# EAGLE design impedance02 (EAGLE 5.10)
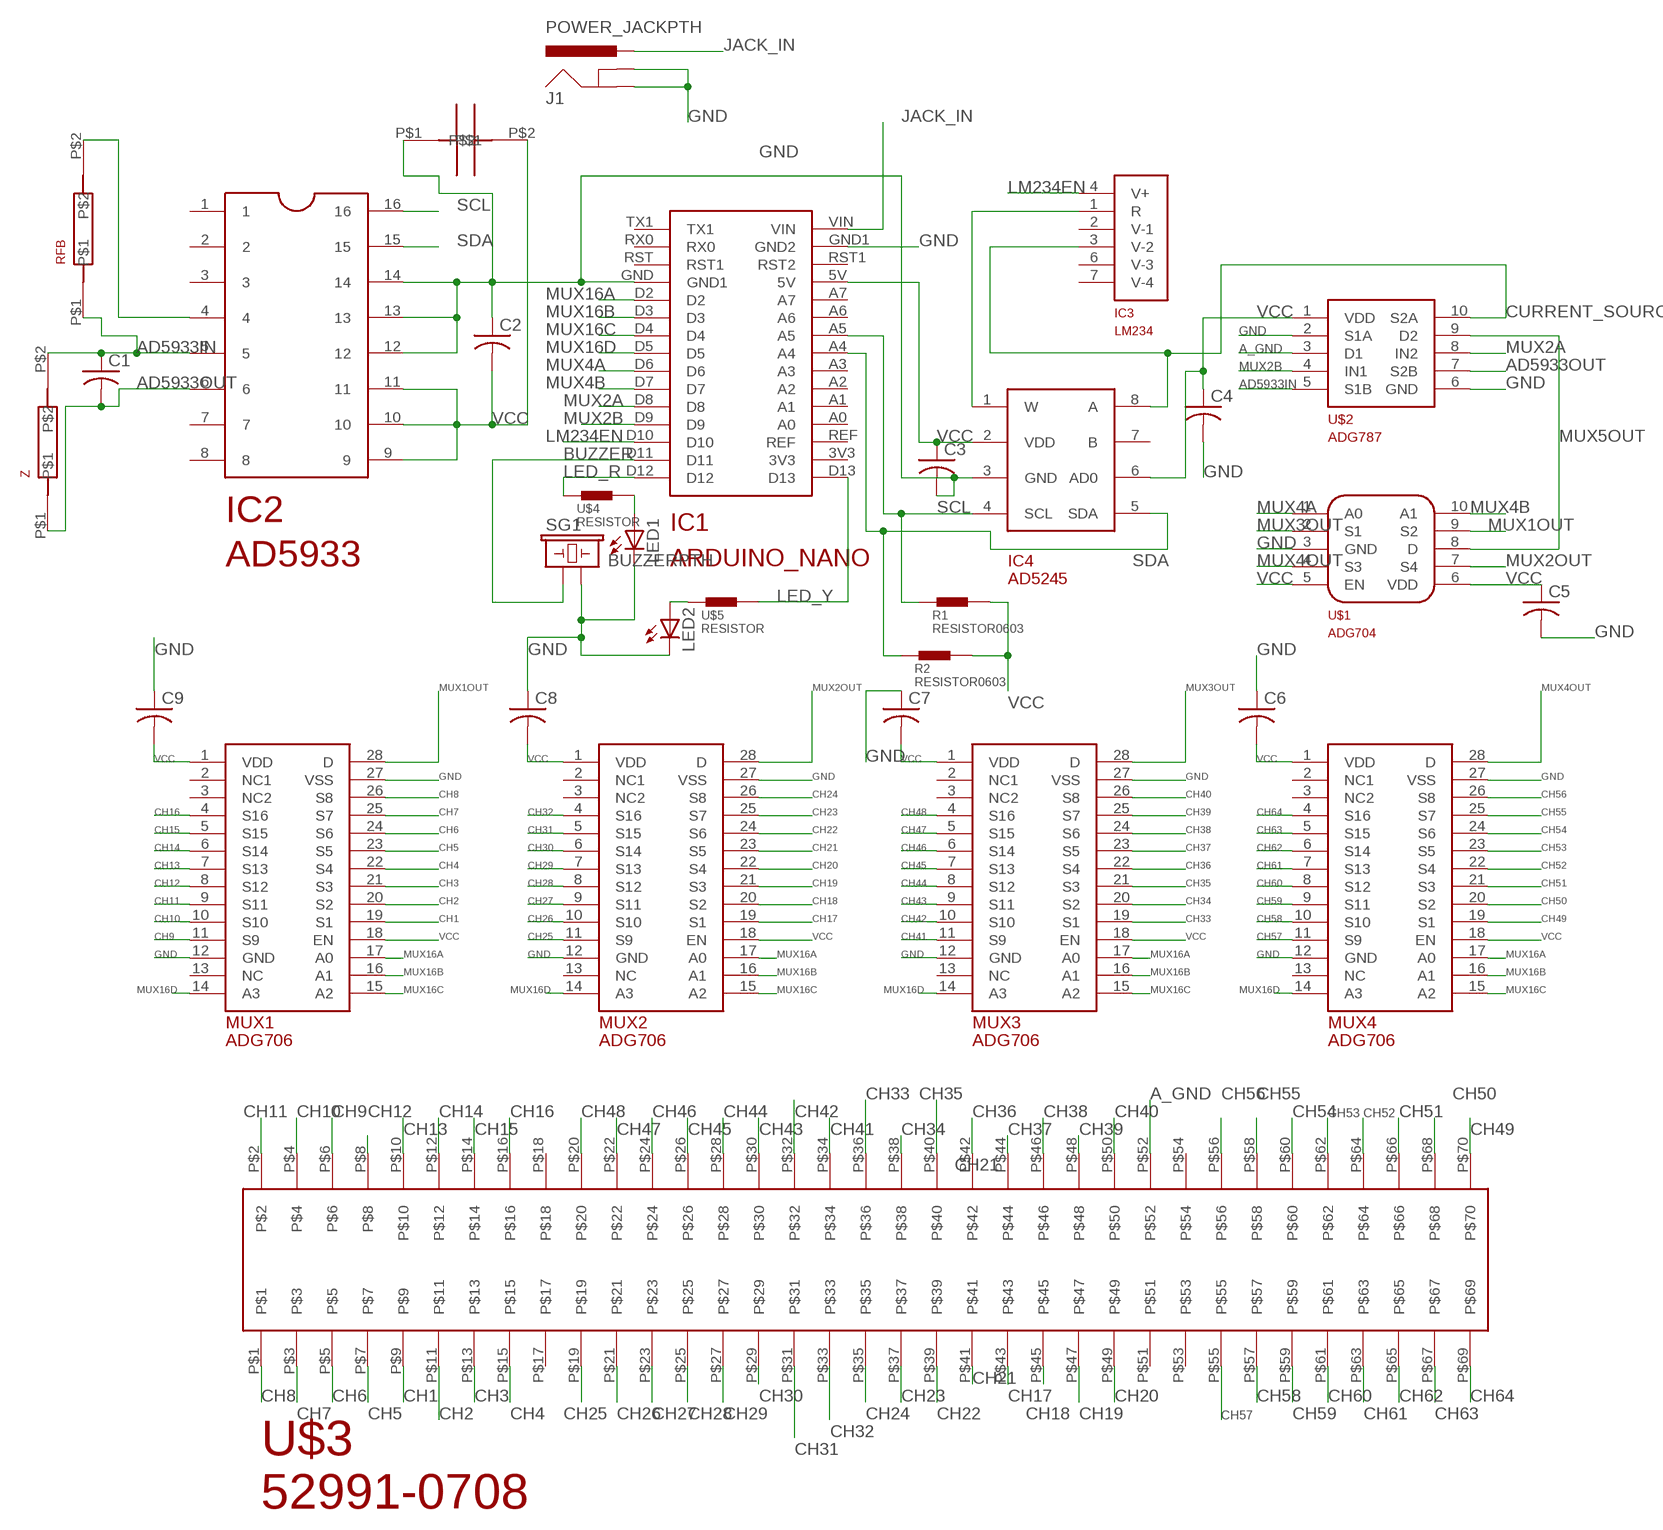
[diagram p0: schematic, sheet 1]

## Parts
C1  C-USC0603  [C0603]
C2  C-USC0603  [C0603]
C3  C-USC0603  [C0603]
C4  C-USC0603  [C0603]
C5  C-USC0603  [C0603]
C6  C-USC0603  [C0603]
C7  C-USC0603  [C0603]
C8  C-USC0603  [C0603]
C9  C-USC0603  [C0603]
IC1  ARDUINO_NANO  [ARDUINO_NANO]
IC2  AD5933  [AD5933]
IC3  LM234  [LM234]
IC4  AD5245  [AD5245]
J1  POWER_JACKPTH  [POWER_JACK_PTH]
LED1  LED5MM  [LED5MM]
LED2  LED5MM  [LED5MM]
MUX1  ADG706  [TSSOP28]
MUX2  ADG706  [TSSOP28]
MUX3  ADG706  [TSSOP28]
MUX4  ADG706  [TSSOP28]
R1  RESISTOR0603  [0603]
R2  RESISTOR0603  [0603]
RFB  RESISTOR_PTH  [RESISTOR_PTH]
SG1  BUZZERPTH  [BUZZER-12MM]
U$1  ADG704  [MICROSOIC10]
U$2  ADG787  [MSOP10]
U$3  52991-0708  [52991-0708]
U$4  RESISTOR  [RESISTOR]
U$5  RESISTOR  [RESISTOR]
U$6  CAPACITOR_PTH  [CAPACITOR_PTH]
Z  RESISTOR_PTH  [RESISTOR_PTH]

## Nets
A_GND: U$2.3(D1) U$3.P$52
AD5933IN: C1.1 IC2.5 RFB.P$1 U$2.5(S1B) Z.P$2
AD5933OUT: C1.2 IC2.6 U$2.7(S2B) Z.P$1
BUZZER: IC1.D11 SG1.+
CH1: MUX1.19(S1) U$3.P$9
CH2: MUX1.20(S2) U$3.P$11
CH3: MUX1.21(S3) U$3.P$13
CH4: MUX1.22(S4) U$3.P$15
CH5: MUX1.23(S5) U$3.P$7
CH6: MUX1.24(S6) U$3.P$5
CH7: MUX1.25(S7) U$3.P$3
CH8: MUX1.26(S8) U$3.P$1
CH9: MUX1.11(S9) U$3.P$6
CH10: MUX1.10(S10) U$3.P$4
CH11: MUX1.9(S11) U$3.P$2
CH12: MUX1.8(S12) U$3.P$8
CH13: MUX1.7(S13) U$3.P$10
CH14: MUX1.6(S14) U$3.P$12
CH15: MUX1.5(S15) U$3.P$14
CH16: MUX1.4(S16) U$3.P$16
CH17: MUX2.19(S1) U$3.P$43
CH18: MUX2.20(S2) U$3.P$45
CH19: MUX2.21(S3) U$3.P$47
CH20: MUX2.22(S4) U$3.P$49
CH21: MUX2.23(S5) U$3.P$41
CH22: MUX2.24(S6) U$3.P$39
CH23: MUX2.25(S7) U$3.P$37
CH24: MUX2.26(S8) U$3.P$35
CH25: MUX2.11(S9) U$3.P$19
CH26: MUX2.10(S10) U$3.P$21
CH27: MUX2.9(S11) U$3.P$23
CH28: MUX2.8(S12) U$3.P$25
CH29: MUX2.7(S13) U$3.P$27
CH30: MUX2.6(S14) U$3.P$29
CH31: MUX2.5(S15) U$3.P$31
CH32: MUX2.4(S16) U$3.P$33
CH33: MUX3.19(S1) U$3.P$36
CH34: MUX3.20(S2) U$3.P$38
CH35: MUX3.21(S3) U$3.P$40
CH36: MUX3.22(S4) U$3.P$42
CH37: MUX3.23(S5) U$3.P$44
CH38: MUX3.24(S6) U$3.P$46
CH39: MUX3.25(S7) U$3.P$48
CH40: MUX3.26(S8) U$3.P$50
CH41: MUX3.11(S9) U$3.P$34
CH42: MUX3.10(S10) U$3.P$32
CH43: MUX3.9(S11) U$3.P$30
CH44: MUX3.8(S12) U$3.P$28
CH45: MUX3.7(S13) U$3.P$26
CH46: MUX3.6(S14) U$3.P$24
CH47: MUX3.5(S15) U$3.P$22
CH48: MUX3.4(S16) U$3.P$20
CH49: MUX4.19(S1) U$3.P$70
CH50: MUX4.20(S2) U$3.P$68
CH51: MUX4.21(S3) U$3.P$66
CH52: MUX4.22(S4) U$3.P$64
CH53: MUX4.23(S5) U$3.P$62
CH54: MUX4.24(S6) U$3.P$60
CH55: MUX4.25(S7) U$3.P$58
CH56: MUX4.26(S8) U$3.P$56
CH57: MUX4.11(S9) U$3.P$55
CH58: MUX4.10(S10) U$3.P$57
CH59: MUX4.9(S11) U$3.P$59
CH60: MUX4.8(S12) U$3.P$61
CH61: MUX4.7(S13) U$3.P$63
CH62: MUX4.6(S14) U$3.P$65
CH63: MUX4.5(S15) U$3.P$67
CH64: MUX4.4(S16) U$3.P$69
CURRENT_SOURCE: IC3.3(V-2) IC4.8(A) U$2.10(S2A)
GND: C2.1 C3.2 C4.2 C5.2 C6.1 C7.1 C8.1 C9.1 IC1.GND1(GND2) IC1.GND(GND1) IC2.12 IC2.13 IC2.14 IC4.3(GND) J1.GND J1.GNDBREAK LED1.K(C) LED2.K(C) MUX1.12(GND) MUX1.27(VSS) MUX2.12(GND) MUX2.27(VSS) MUX3.12(GND) MUX3.27(VSS) MUX4.12(GND) MUX4.27(VSS) SG1.- U$1.3(GND) U$2.2(S1A) U$2.6(GND) U$6.P$1
JACK_IN: IC1.VIN J1.PWR
LED_R: IC1.D12 U$4.P$1(P2)
LED_Y: IC1.D13 U$5.P$2(P1)
LM234EN: IC1.D10 IC3.4(V+)
MUX1OUT: MUX1.28(D) U$1.9(S2)
MUX2A: IC1.D8 U$2.8(IN2)
MUX2B: IC1.D9 U$2.4(IN1)
MUX2OUT: MUX2.28(D) U$1.7(S4)
MUX3OUT: MUX3.28(D) U$1.2(S1)
MUX4A: IC1.D6 U$1.1(A0)
MUX4B: IC1.D7 U$1.10(A1)
MUX4OUT: MUX4.28(D) U$1.4(S3)
MUX5OUT: U$1.8(D) U$2.9(D2)
MUX16A: IC1.D2 MUX1.17(A0) MUX2.17(A0) MUX3.17(A0) MUX4.17(A0)
MUX16B: IC1.D3 MUX1.16(A1) MUX2.16(A1) MUX3.16(A1) MUX4.16(A1)
MUX16C: IC1.D4 MUX1.15(A2) MUX2.15(A2) MUX3.15(A2) MUX4.15(A2)
MUX16D: IC1.D5 MUX1.14(A3) MUX2.14(A3) MUX3.14(A3) MUX4.14(A3)
N$1: LED1.A U$4.P$2(P1)
N$2: IC3.1(R) IC4.1(W)
N$3: IC2.4 RFB.P$2
N$4: LED2.A U$5.P$1(P2)
SCL: IC1.A5 IC2.16 IC4.4(SCL) R1.P$2(P2)
SDA: IC1.A4 IC2.15 IC4.5(SDA) R2.P$2(P2)
VCC: C2.2 C3.1 C4.1 C5.1 C6.2 C7.2 C8.2 C9.2 IC1.5V IC2.9 IC2.10 IC2.11 IC4.2(VDD) IC4.6(AD0) MUX1.1(VDD) MUX1.18(EN) MUX2.1(VDD) MUX2.18(EN) MUX3.1(VDD) MUX3.18(EN) MUX4.1(VDD) MUX4.18(EN) R1.P$1(P1) R2.P$1(P1) U$1.5(EN) U$1.6(VDD) U$2.1(VDD) U$6.P$2
Unconnected: IC1.3V3 IC1.A0 IC1.A1 IC1.A2 IC1.A3 IC1.A6 IC1.A7 IC1.REF IC1.RST1(RST2) IC1.RST(RST1) IC1.RX0 IC1.TX1 IC2.1 IC2.2 IC2.3 IC2.7 IC2.8 IC3.2(V-1) IC3.6(V-3) IC3.7(V-4) IC4.7(B) MUX1.2(NC1) MUX1.3(NC2) MUX1.13(NC) MUX2.2(NC1) MUX2.3(NC2) MUX2.13(NC) MUX3.2(NC1) MUX3.3(NC2) MUX3.13(NC) MUX4.2(NC1) MUX4.3(NC2) MUX4.13(NC) U$3.P$17 U$3.P$18 U$3.P$51 U$3.P$53 U$3.P$54

## Library data of the parts
C1-C9 = resistor:C-US: CAPACITOR, American symbol
IC1 = josh:ARDUINO_NANO
IC2 = analog-devices:AD5933
IC3 = josh:LM234
IC4 = analog-devices:AD5245
J1 = sparkfun:POWER_JACK: Power Jack This is the standard 5.5mm barrel jack for power. The PTH is the most common, proven, reliable, footprint. All others are experimental. The Slot footprint only works if the mill layer is transmitted to the PCB fab house so be warned. Spark Fun Electronics SKU : PRT-00119. Mating wall wart : TOL-00298 (and others)
LED1 LED2 = sparkfun:LED: LEDs Standard schematic elements and footprints for 5mm, 3mm, 1206, and 0603 sized LEDs. 5mm - Spark Fun Electronics SKU : COM-00529 (and others)
MUX1-MUX4 = analog-devices:ADG706
R1 R2 U$4 U$5 = josh:RESISTOR
RFB Z = josh:RESISTOR_PTH
SG1 = sparkfun:BUZZER: Buzzer 12mm Spark Fun Electronics SKU : Comp-Buzzer
U$1 = analog-devices:ADG704
U$2 = analog-devices:ADG787
U$3 = molex:52991-0708
U$6 = josh:CAPACITOR_PTH

## Board
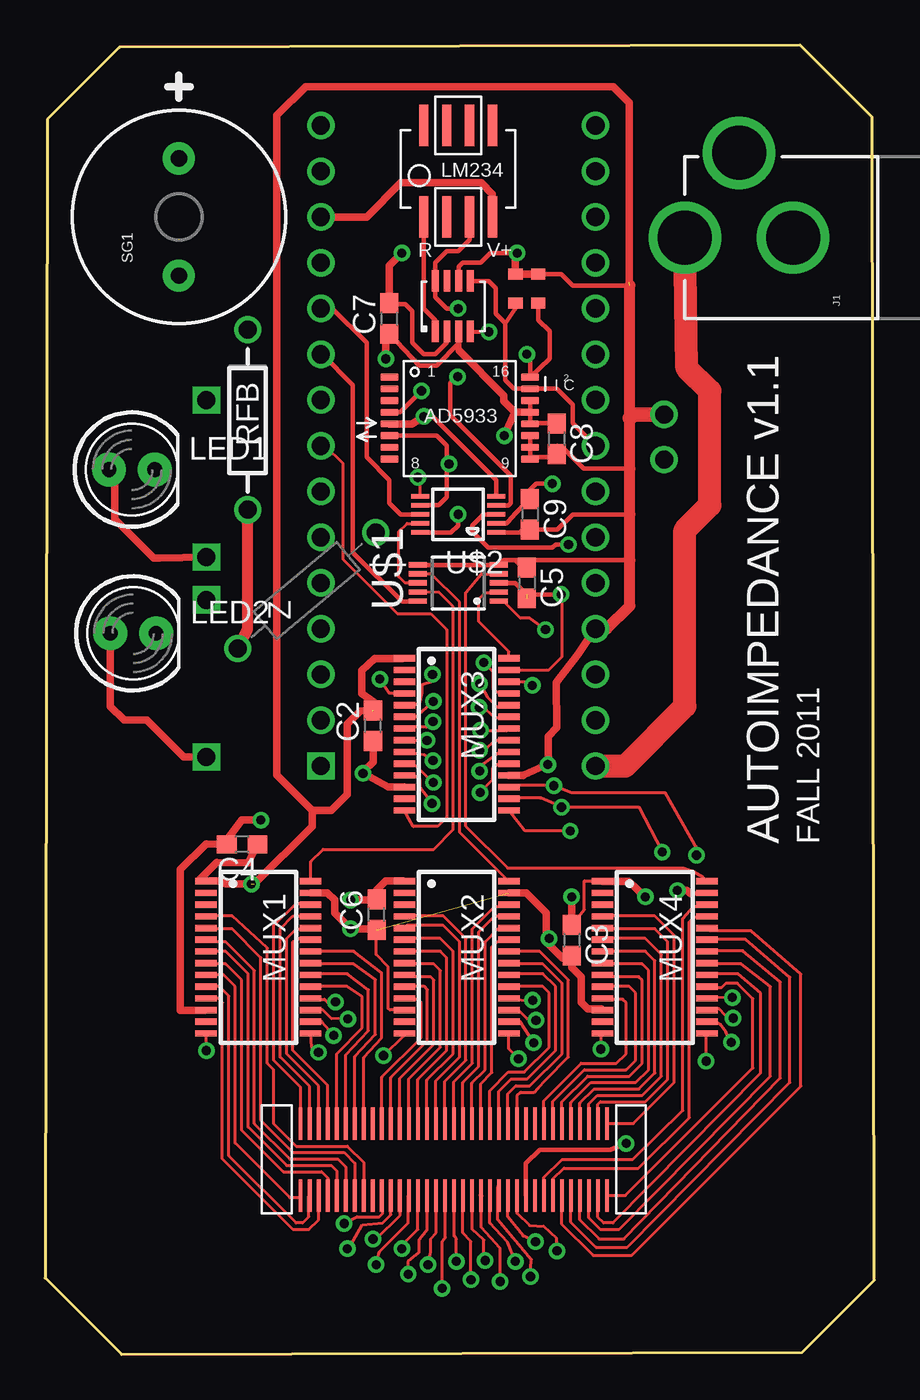
[diagram p1: board, top side]
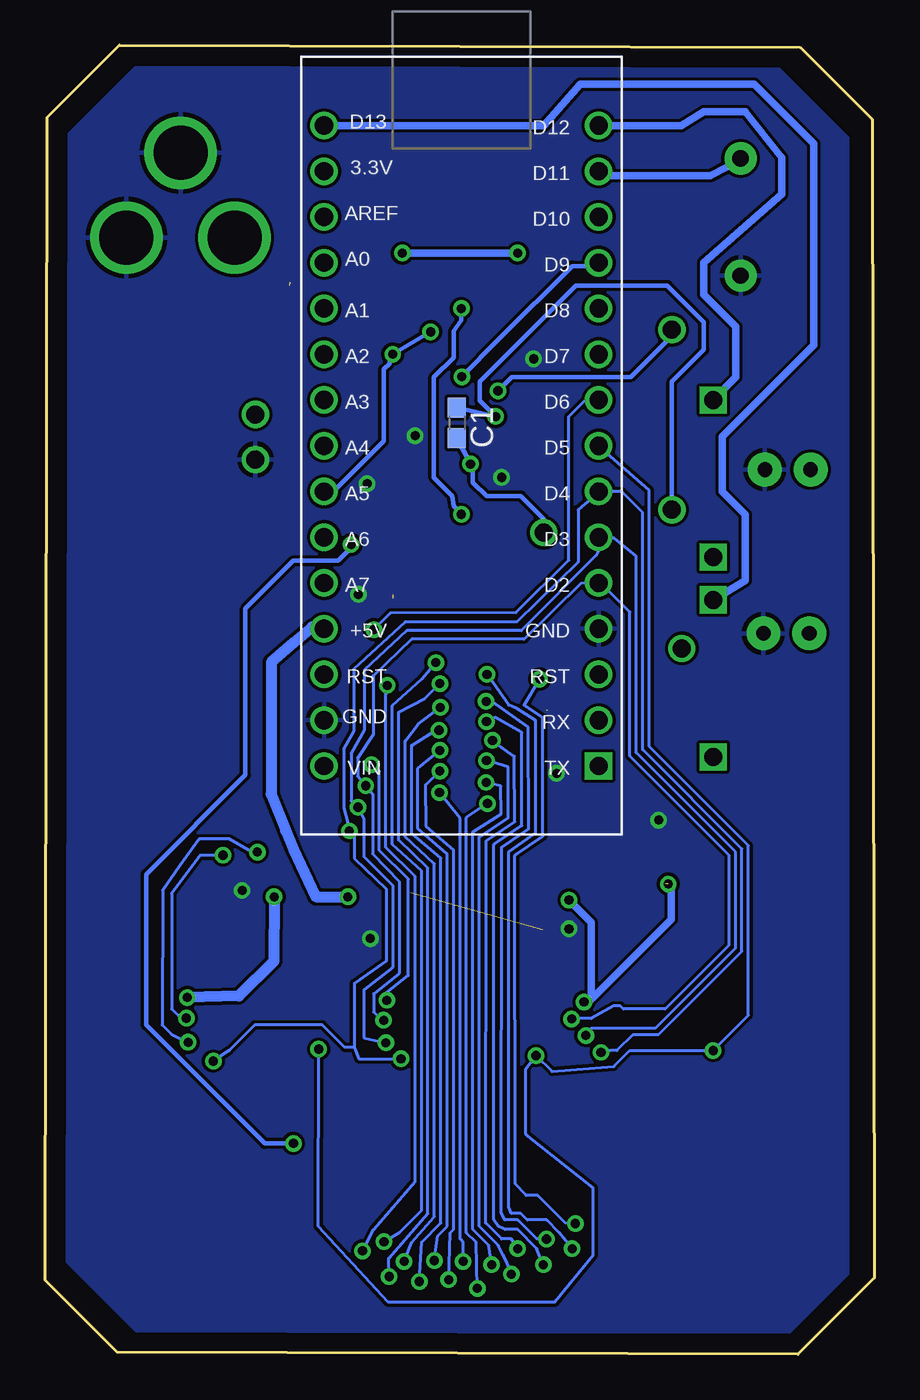
[diagram p2: board, bottom side, seen from below]

Size 46.03 x 72.7 mm. Coordinates in mm from the lower left corner, seen from the top.
Outline: 0.13,68.57 0,4.25 4.25,0 42.03,0.13 46.03,4.13 45.91,68.7 41.91,72.7 4.13,72.57 0.13,68.57
Copper layers (1*16): Top 0.035mm / dielectric 1.5mm / Bottom 0.035mm
Design rules "default *": minimum track width 7mil, minimum drill 20mil, track to track 7mil, track to pad 7mil, pad to pad 7mil, via to via 7mil, smd to smd 7mil, copper to edge 40mil, drill to drill 8mil, minimum pad ring 10mil, minimum via ring 8mil, stop-mask expansion 4mil, vias tented up to drill 0mil, thermal gap 10mil

### Footprints (pad centres in the part's own frame; a part is rotated, then mirrored left to right if it is on the bottom)
C0603 = smd 1.1 x 1: 1 -0.85,0; 2 0.85,0
ARDUINO_NANO = drill 1.016 round: 3V3 15.24,2.54; 5V 15.24,27.94; A0 15.24,7.62; A1 15.24,10.16; A2 15.24,12.7; A3 15.24,15.24; A4 15.24,17.78; A5 15.24,20.32; A6 15.24,22.86; A7 15.24,25.4; D2 0,25.4; D3 0,22.86; D4 0,20.32; D5 0,17.78; D6 0,15.24; D7 0,12.7; D8 0,10.16; D9 0,7.62; D10 0,5.08; D11 0,2.54; D12 0,0; D13 15.24,0; GND 15.24,33.02; GND1 0,27.94; REF 15.24,5.08; RST 15.24,30.48; RST1 0,30.48; RX0 0,33.02; VIN 15.24,35.56 | drill 1.016 square: TX1 0,35.56
AD5933 = smd 0.4 x 1: 1 0,0; 2 0.65,0; 3 1.3,0; 4 1.95,0; 5 2.6,0; 6 3.25,0; 7 3.9,0; 8 4.55,0; 9 4.55,7.8; 10 3.9,7.8; 11 3.25,7.8; 12 2.6,7.8; 13 1.95,7.8; 14 1.3,7.8; 15 0.65,7.8; 16 0,7.8
LM234 = smd 0.508 x 2.286: 1 0,0; 2 1.27,0; 3 2.54,0; 4 3.81,0; 5 3.81,5.08; 6 2.54,5.08; 7 1.27,5.08; 8 0,5.08
AD5245 = smd 0.38 x 1.2: 1 0,0; 2 0.65,0; 3 1.3,0; 4 1.95,0; 5 1.95,2.8; 6 1.3,2.8; 7 0.65,2.8; 8 0,2.8
POWER_JACK_PTH = drill 2.997 round: GND 0,7.7; GNDBREAK 4.7,10.7; PWR 0,13.7
LED5MM = drill 0.813 pad 1.88 round: A -1.27,0; K 1.27,0
TSSOP28 = smd 0.35 x 1.2: 1 -4.225,-2.9; 2 -3.575,-2.9; 3 -2.925,-2.9; 4 -2.275,-2.9; 5 -1.625,-2.9; 6 -0.975,-2.9; 7 -0.325,-2.9; 8 0.325,-2.9; 9 0.975,-2.9; 10 1.625,-2.9; 11 2.275,-2.9; 12 2.925,-2.9; 13 3.575,-2.9; 14 4.225,-2.9; 15 4.225,2.9; 16 3.575,2.9; 17 2.925,2.9; 18 2.275,2.9; 19 1.625,2.9; 20 0.975,2.9; 21 0.325,2.9; 22 -0.325,2.9; 23 -0.975,2.9; 24 -1.625,2.9; 25 -2.275,2.9; 26 -2.925,2.9; 27 -3.575,2.9; 28 -4.225,2.9
0603 = smd 0.6 x 0.8: P$1 0,0; P$2 1.6,0
RESISTOR_PTH = drill 1 round: P$1 0,0; P$2 10,0
BUZZER-12MM = drill 0.9 pad 1.778 round: + 3.25,0; - -3.25,0
MICROSOIC10 = smd 0.3 x 1: 1 -1,-2.25; 2 -0.5,-2.25; 3 0,-2.25; 4 0.5,-2.25; 5 1,-2.25; 6 1,2.25; 7 0.5,2.25; 8 0,2.25; 9 -0.5,2.25; 10 -1,2.25
MSOP10 = smd 0.25 x 1: 1 -1,-2.113; 2 -0.5,-2.113; 3 0,-2.113; 4 0.5,-2.113; 5 1,-2.113; 6 1,2.113; 7 0.5,2.113; 8 0,2.113; 9 -0.5,2.113; 10 -1,2.113
52991-0708 = smd 0.25 x 1.8: P$1 0,2; P$2 0,-2; P$3 0.5,2; P$4 0.5,-2; P$5 1,2; P$6 1,-2; P$7 1.5,2; P$8 1.5,-2; P$9 2,2; P$10 2,-2; P$11 2.5,2; P$12 2.5,-2; P$13 3,2; P$14 3,-2; P$15 3.5,2; P$16 3.5,-2; P$17 4,2; P$18 4,-2; P$19 4.5,2; P$20 4.5,-2; P$21 5,2; P$22 5,-2; P$23 5.5,2; P$24 5.5,-2; P$25 6,2; P$26 6,-2; P$27 6.5,2; P$28 6.5,-2; P$29 7,2; P$30 7,-2; P$31 7.5,2; P$32 7.5,-2; P$33 8,2; P$34 8,-2; P$35 8.5,2; P$36 8.5,-2; P$37 9,2; P$38 9,-2; P$39 9.5,2; P$40 9.5,-2; P$41 10,2; P$42 10,-2; P$43 10.5,2; P$44 10.5,-2; P$45 11,2; P$46 11,-2; P$47 11.5,2; P$48 11.5,-2; P$49 12,2; P$50 12,-2; P$51 12.5,2; P$52 12.5,-2; P$53 13,2; P$54 13,-2; P$55 13.5,2; P$56 13.5,-2; P$57 14,2; P$58 14,-2; P$59 14.5,2; P$60 14.5,-2; P$61 15,2; P$62 15,-2; P$63 15.5,2; P$64 15.5,-2; P$65 16,2; P$66 16,-2; P$67 16.5,2; P$68 16.5,-2; P$69 17,2; P$70 17,-2
RESISTOR = drill 1 square: P$1 -2.54,0; P$2 6.175,0
CAPACITOR_PTH = drill 1 round: P$1 0,0; P$2 2.5,0

### Placement (x,y rotation side)
C1  23.18,51.72 270 bottom
C2  18.2,34.91 90 top
C3  29.23,22.99 270 top
C4  10.94,28.33 180 top
C5  26.74,42.83 270 top
C6  18.4,24.42 90 top
C7  19.12,57.51 90 top
C8  28.39,50.83 270 top
C9  26.91,46.64 270 top
IC1  15.31,68.23 180 bottom
IC2  19.12,54.26 270 top
IC3  21.02,63.15 0 top
IC4  21.66,56.8 0 top
J1  49.21,62.01 90 top
LED1  4.82,49.13 0 top
LED2  4.89,40.04 0 top
MUX1  11.84,22.05 270 top
MUX2  22.84,22.05 270 top
MUX3  22.84,34.42 270 top
MUX4  33.84,22.05 270 top
R1  27.37,59.98 270 top
R2  26.1,59.98 270 top
RFB  11.24,46.9 90 top
SG1  7.43,63.15 90 top
U$1  22.93,42.83 90 top
U$2  22.93,46.64 90 top
U$3  14.19,10.83 0 top
U$4  8.96,50.45 270 top
U$5  8.96,35.72 90 top
U$6  34.36,49.69 90 top
Z  18.35,45.63 220 top

### Tracks (layer width: path | path; a pad name or v marks a point on that pad's centre or on a via)
A_GND  (via drill 0.51)
  Top 0.254: U$3.P$52 26.69,10.6 27.45,11.36 31.36,11.36 v32.25,11.72 | U$2.3 24.32,46.64 23.71,46.03 23.71,45.68 24.6,44.79 28.16,44.79 28.34,44.97 v29.05,44.97
  Bottom 0.254: v29.05,44.97 29.05,44.79 29.76,44.08 32.25,44.08 34.91,41.41 34.91,32.16 40.43,26.65 40.43,18.3 33.85,11.72 v32.25,11.72
AD5933IN  (via drill 0.51)
  Top 0.254: U$2.5 25.04,48.54 21.5,52.08 v21.02,52.08
  Top 0.406: IC2.5 20.35,51.66 v21.02,52.08
  Top 0.61: RFB.P$1 11.24,40.26 Z.P$2
  Bottom 0.254: C1.1 21.01,52.06 v21.02,52.08 21.91,52.97 21.91,54.01 16.58,59.34 11.5,59.34 9.46,57.31 9.46,55.79 11.24,54.01 RFB.P$1
AD5933OUT  (via drill 0.51)
  Top 0.254: IC2.6 21.73,51.01 22.29,50.45 22.29,49.56 | 22.29,49.56 22.29,47.6 21.84,47.15 20.95,47.15 U$2.7 | v22.42,49.44 22.29,49.56
  Bottom 0.254: C1.2 v22.42,49.44 22.29,49.31 22.29,48.42 21.53,47.66 19.62,47.66 18.35,46.39 Z.P$1
BUZZER
  Bottom 0.406: SG1.+ 7.23,66.43 9.11,65.44 15.05,65.44 IC1.D11
CH1
  Top 0.178: U$3.P$9 16.19,16.69 17.59,18.14 17.59,19.87 16.78,20.43 MUX1.19
CH2
  Top 0.178: U$3.P$11 16.69,16.63 17.95,17.97 17.95,20.25 16.78,21.14 14.81,21.14 MUX1.20
CH3
  Top 0.178: U$3.P$13 17.19,16.55 18.33,17.76 18.33,20.81 17.13,21.67 14.79,21.67 MUX1.21
CH4
  Top 0.178: U$3.P$15 17.69,16.49 18.68,17.58 18.68,21.19 17.13,22.38 14.75,22.38 MUX1.22
CH5
  Top 0.178: U$3.P$7 15.69,14.94 13.76,16.87 13.76,22.92 14.11,23.1 14.67,23.1 MUX1.23
CH6
  Top 0.178: U$3.P$5 15.19,14.91 13.4,16.7 13.4,23.1 13.93,23.63 14.7,23.63 MUX1.24
CH7
  Top 0.178: U$3.P$3 14.69,14.88 13.04,16.52 13.04,23.63 13.76,24.34 14.72,24.34 MUX1.25
CH8
  Top 0.178: U$3.P$1 14.19,14.84 12.69,16.34 12.69,23.81 13.93,25.05 14.66,25.05 MUX1.26
CH9
  Top 0.178: MUX1.11 9.61,19.77 9.85,19.54 9.85,10.85 13.76,6.94 14.65,6.94 15.18,7.47 15.18,8.82 U$3.P$6
CH10
  Top 0.178: MUX1.10 9.67,20.42 10.2,19.9 10.2,11.03 13.93,7.3 14.29,7.3 14.65,7.65 14.65,8.79 U$3.P$4
CH11
  Top 0.178: MUX1.9 9.91,21.07 10.56,20.43 10.56,11.74 13.58,8.72 14.08,8.72 U$3.P$2
CH12
  Top 0.178: U$3.P$8 15.69,9.81 15.36,10.14 13.22,10.14 10.91,12.45 10.91,20.78 10.02,21.67 8.99,21.67 MUX1.8
CH13
  Top 0.178: U$3.P$10 16.19,10.2 15.89,10.5 13.4,10.5 11.27,12.63 11.27,21.14 10.02,22.38 8.95,22.38 MUX1.7
CH14
  Top 0.178: U$3.P$12 16.69,10.41 16.25,10.85 13.58,10.85 11.62,12.81 11.62,21.32 10.02,22.92 9.05,22.92 MUX1.6
CH15
  Top 0.178: U$3.P$14 17.19,10.62 16.6,11.21 13.76,11.21 11.98,12.99 11.98,22.03 10.38,23.63 8.99,23.63 MUX1.5
CH16
  Top 0.178: U$3.P$16 17.69,10.65 16.78,11.56 13.93,11.56 12.69,12.81 12.69,15.81 12.33,16.16 12.33,22.56 10.38,24.34 8.96,24.34 MUX1.4
CH17
  Top 0.178: MUX2.19 27.62,20.43 27.98,20.07 27.98,17.05 26.61,15.68 25.72,15.68 24.69,14.65 U$3.P$43
CH18
  Top 0.178: MUX2.20 25.81,21.14 27.62,21.14 28.34,20.43 28.34,16.87 26.76,15.3 25.87,15.3 25.19,14.61 U$3.P$45
CH19
  Top 0.178: MUX2.21 25.79,21.67 27.62,21.67 28.69,20.61 28.69,16.7 26.91,14.92 26.13,14.92 25.69,14.48 U$3.P$47
CH20
  Top 0.178: MUX2.22 27.46,22.37 29.05,20.78 29.05,16.52 27.8,15.27 27.35,14.76 27.14,14.56 26.41,14.56 26.2,14.38 26.2,13.71 U$3.P$49
CH21
  Top 0.178: U$3.P$41 24.19,15.04 24.81,15.65 24.78,22.61 25.31,23.1 25.67,23.1 MUX2.23
CH22
  Top 0.178: U$3.P$39 23.69,15.07 24.42,15.81 24.42,22.92 25.14,23.63 25.7,23.63 MUX2.24
CH23
  Top 0.178: U$3.P$37 23.19,15.1 24.07,15.98 24.07,23.45 24.96,24.34 25.72,24.34 MUX2.25
CH24
  Top 0.178: U$3.P$35 22.69,15.14 23.71,16.16 23.71,23.63 24.96,24.87 25.64,24.87 MUX2.26
CH25
  Top 0.178: U$3.P$19 18.69,15.4 20.87,17.58 20.87,19.54 20.69,19.72 20,19.72 MUX2.11
CH26
  Top 0.178: U$3.P$21 19.19,15.37 21.22,17.41 21.22,20.25 21.05,20.43 MUX2.10
CH27
  Top 0.178: U$3.P$23 19.69,15.34 21.58,17.23 21.58,20.78 21.4,20.96 20.05,20.96 MUX2.9
CH28
  Top 0.178: U$3.P$25 20.19,15.3 21.94,17.05 21.94,21.32 21.58,21.67 19.99,21.67 MUX2.8
CH29
  Top 0.178: U$3.P$27 20.69,15.27 22.29,16.87 22.29,22.03 21.94,22.38 19.95,22.38 MUX2.7
CH30
  Top 0.178: U$3.P$29 21.19,15.24 22.65,16.7 22.65,22.38 21.94,23.1 20.02,23.1 MUX2.6
CH31
  Top 0.178: MUX2.5 20.08,23.81 22.11,23.81 23,22.92 23,16.52 21.69,15.2 U$3.P$31
CH32
  Top 0.178: U$3.P$33 22.19,15.17 23.36,16.34 23.36,23.1 22.11,24.34 19.96,24.34 MUX2.4
CH33  (via drill 0.51)
  Top 0.178: MUX3.19 25.67,32.88 25.29,32.88 24.86,32.57 24.86,31.94 v24.14,31.2 | v22.82,5.16 22.82,6.41 22.7,6.59 22.7,8.79 U$3.P$36
  Bottom 0.178: v22.82,5.16 22.82,6.23 23,6.41 23,29.75 v24.14,31.2
CH34  (via drill 0.51)
  Top 0.178: MUX3.20 25.7,33.41 25.29,33.48 24.3,32.75 24.09,32.44 v24.12,32.39 | v23.64,4.15 23.64,6.28 23.18,6.76 23.18,8.82 U$3.P$38
  Bottom 0.178: v23.64,4.15 23.54,6.76 23.36,6.94 23.36,28.02 24.88,29.32 24.91,31.63 v24.12,32.39
CH35  (via drill 0.51)
  Top 0.178: MUX3.21 25.72,34.12 25.14,34.12 24.83,33.94 24.58,33.74 v24.12,33.54 | v24.42,5.21 24.42,5.24 24.35,5.32 24.35,6.36 23.71,6.94 23.71,8.8 U$3.P$40
  Bottom 0.178: v24.42,5.21 24.25,6.59 23.71,7.12 23.71,27.8 25.34,29.19 25.34,32.55 v24.12,33.54
CH36  (via drill 0.51)
  Top 0.178: MUX3.22 25.65,34.65 v24.17,34.65 | v25.26,4.05 25.26,5.9 24.2,7.07 24.2,8.8
  Top 0.254: 24.2,8.8 U$3.P$42
  Bottom 0.178: v25.26,4.05 25.14,6.23 24.07,7.3 24.07,27.57 25.7,28.94 25.7,33.82 24.64,34.48 v24.17,34.65
CH37  (via drill 0.51)
  Top 0.178: MUX3.23 25.71,35.36 24.96,35.36 24.45,35.8 | v26.1,5.16 25.67,6.23 24.68,7.3 24.68,8.74 U$3.P$44 | 24.45,35.8 24.5,35.8 | v24.09,35.92 24.45,35.8
  Bottom 0.178: v26.1,5.16 25.67,6.23 24.42,7.65 24.42,27.24 26.05,28.73 26.05,34.07 25.31,35.01 v24.09,35.92
CH38  (via drill 0.51)
  Top 0.178: MUX3.24 25.72,36.08 25.26,35.95 25.11,35.95 24.55,36.51 v24.12,37.24 | v26.94,4.33 26.99,5.27 25.14,7.47 25.14,8.9 | 25.14,8.9 25.14,9.25 25.19,9.41 25.19,8.93 U$3.P$46 25.19,8.85 25.14,8.9
  Bottom 0.178: v26.94,4.33 26.96,5.34 24.78,7.83 24.78,27.01 26.41,28.56 26.41,35.67 24.96,36.43 v24.12,37.24
CH39  (via drill 0.51)
  Top 0.178: MUX3.25 25.78,36.74 25.16,36.71 24.86,36.94 24.86,37.93 24.78,37.98 v24.35,38.41 | v27.22,6.26 26.53,6.59 25.67,7.65 25.67,8.81 U$3.P$48
  Bottom 0.178: v27.22,6.26 26.38,6.76 25.14,8.01 25.14,26.86 26.76,28.33 26.76,36.02 25.14,37.5 v24.35,38.41
CH40  (via drill 0.51)
  Top 0.178: MUX3.26 25.71,37.32 25.44,37.3 26.13,37.35 26.86,37.35 v27.04,37.14 | v28.41,5.75 28.36,6.48 27.68,7.12 26.89,7.17 26.2,7.83 26.2,8.81 U$3.P$50
  Bottom 0.178: v28.41,5.75 27.8,6.94 25.49,9.61 25.49,26.55 27.12,28.15 27.12,36.66 | 27.12,36.66 27.12,36.79 | 27.12,36.66 v27.04,37.14
CH41  (via drill 0.51)
  Top 0.178: v22.04,3.67 22.04,6.28 22.21,6.51 22.21,8.75 U$3.P$34 | MUX3.11 19.96,32.16 20.39,32.22 20.82,31.94 20.82,31.45 v21.48,30.59
  Bottom 0.178: v22.04,3.67 22.11,6.23 22.65,6.76 22.65,29.8 v21.48,30.59
CH42  (via drill 0.51)
  Top 0.178: v21.25,4.99 21.4,5.7 21.4,6.41 21.71,6.76 21.71,8.76 U$3.P$32 | MUX3.10 19.97,32.85 20.46,32.85 20.49,32.82 20.49,32.75 v21.55,31.76
  Bottom 0.178: v21.25,4.99 21.4,6.05 22.29,6.94 22.29,29.01 20.72,30.01 20.74,31.55 v21.55,31.76
CH43  (via drill 0.51)
  Top 0.178: v20.16,4.45 20.16,5.16 20.77,5.67 20.77,6.38 21.2,6.94 21.2,8.79 U$3.P$30 | MUX3.9 19.98,33.41 21.07,33.28 v21.53,32.98
  Bottom 0.178: v20.16,4.45 20.41,5.14 20.59,5.52 20.87,6.05 21.94,7.12 21.94,28.71 20.34,29.78 20.34,32.62 v21.53,32.98
CH44  (via drill 0.51)
  Top 0.178: v19.8,5.88 19.8,6.05 20.69,6.94 U$3.P$28 | v21.2,34.09 21.15,34.09 19.97,34.07 MUX3.8
  Bottom 0.178: v21.2,34.09 20.89,33.84 19.98,33.21 19.95,29.57 21.55,28.51 21.58,7.3 20.69,6.41 20.16,6.41 v19.8,5.88
CH45  (via drill 0.51)
  Top 0.178: v18.38,4.99 18.56,5.7 20.16,7.3 20.16,8.8 U$3.P$26 | MUX3.7 20.02,34.83 21.17,34.83 v21.53,35.14
  Bottom 0.178: v18.38,4.99 18.73,5.88 19.8,6.94 20.51,6.94 20.87,7.12 21.12,7.47 21.12,28.3 19.57,29.37 19.57,34.53 21.05,35.36 v21.53,35.14 21.68,35.24
CH46  (via drill 0.51)
  Top 0.178: v18.2,6.41 18.38,6.41 19.7,7.73 19.7,8.84 U$3.P$24 | MUX3.6 20.48,35.4 20.51,35.36 v21.55,36.25
  Bottom 0.178: v18.2,6.41 18.73,6.41 19.8,7.47 20.51,7.47 20.72,7.88 20.69,28.15 19.19,29.17 19.22,34.83 21.22,36.25 21.58,36.38 v21.55,36.25
CH47  (via drill 0.51)
  Top 0.178: v16.78,5.88 16.96,6.05 17.62,7.2 18.73,7.3 19.19,7.76 U$3.P$22 | MUX3.5 19.97,36.08 20.56,36.08 20.77,36.13 20.92,36.71 20.92,37.17 21.5,37.37 v21.5,37.75
  Bottom 0.178: v16.78,5.88 17.49,6.76 18.2,7.47 19.27,7.47 19.62,7.83 20.16,7.83 20.31,8.19 20.31,27.9 18.81,28.96 18.81,35.2 19.87,35.87 20.31,36.05 v21.5,37.75
CH48  (via drill 0.51)
  Top 0.178: v16.6,7.27 17.31,7.65 18.56,7.65 18.73,7.83 18.73,8.78 U$3.P$20 | MUX3.4 20.03,36.61 19.93,36.61 19.7,36.71 19.12,36.71 v18.58,37.5
  Bottom 0.178: v18.58,37.5 19.45,36.05 18.41,35.36 18.41,28.76 19.96,27.69 19.93,9.48 19.34,8.83 U$3.P$20 17.16,7.3 v16.6,7.27
CH49
  Top 0.178: U$3.P$70 32.2,8.83 39.28,15.91 39.28,19.74 38.42,20.61 37.78,20.61 37.53,20.35 36.81,20.35 MUX4.19
CH50
  Top 0.178: U$3.P$68 30.69,7.61 31,7.3 31.51,7.3 39.71,15.63 39.71,20.07 38.47,21.14 36.81,21.14 MUX4.20
CH51
  Top 0.178: U$3.P$66 30.19,7.58 30.82,6.94 31.87,6.94 40.25,15.45 40.25,20.43 38.65,21.67 36.79,21.67 MUX4.21
CH52
  Top 0.178: U$3.P$64 29.69,7.47 30.75,6.41 32.12,6.41 40.81,15.35 40.81,20.68 38.73,22.41 36.78,22.41 MUX4.22
CH53
  Top 0.178: U$3.P$62 29.19,7.33 30.57,5.95 32.32,5.95 41.34,15.1 41.34,20.94 38.88,23.05 36.76,23.05 MUX4.23
CH54
  Top 0.178: U$3.P$60 28.69,7.22 30.42,5.49 32.55,5.49 41.95,14.89 41.95,21.12 39.18,23.53 36.89,23.53 MUX4.24
CH55
  Top 0.178: U$3.P$58 28.19,9.74 28.79,10.35 32.93,10.35 35.75,13.14 35.75,24.01 36.01,24.29 36.71,24.29 MUX4.25
CH56
  Top 0.178: U$3.P$56 27.69,9.83 28.69,10.83 32.6,10.83 35.4,13.55 35.4,24.21 35.98,24.87 36.64,24.87 MUX4.26
CH57
  Top 0.178: U$3.P$55 27.69,14.09 29.76,16.16 31.71,16.16 32.25,16.7 32.25,19.54 32.07,19.72 31,19.72 MUX4.11
CH58
  Top 0.178: U$3.P$57 28.19,14.06 29.94,15.81 32.25,15.81 32.78,16.34 32.78,20.07 32.43,20.43 MUX4.10
CH59
  Top 0.178: U$3.P$59 28.69,14.03 30.11,15.45 32.43,15.45 33.14,16.16 33.14,20.78 32.96,20.96 31.05,20.96 MUX4.9
CH60
  Top 0.178: U$3.P$61 29.19,13.99 30.29,15.1 32.78,15.1 33.49,15.81 33.49,21.32 33.14,21.67 30.99,21.67 MUX4.8
CH61
  Top 0.178: U$3.P$63 29.69,13.96 30.47,14.74 32.96,14.74 33.85,15.63 33.85,21.85 33.31,22.38 30.95,22.38 MUX4.7
CH62
  Top 0.178: U$3.P$65 30.19,13.92 30.65,14.38 33.14,14.38 34.2,15.45 34.2,22.21 33.31,23.1 30.87,23.1 MUX4.6
CH63
  Top 0.178: U$3.P$67 30.69,13.89 30.82,14.03 33.31,14.03 34.56,15.27 34.56,22.92 33.85,23.63 31.25,23.63 MUX4.5
CH64
  Top 0.178: U$3.P$69 32.65,12.83 34.91,15.1 34.91,23.27 33.85,24.34 30.96,24.34 MUX4.4
CURRENT_SOURCE  (via drill 0.51)
  Top 0.254: IC3.3 23.56,61.88 22.93,61.25 22.29,61.25 21.66,60.61 IC4.8 21.66,58.71 22.29,58.07 v22.93,58.07 | v22.93,46.64 22.93,46.01 22.52,45.63 21.31,45.63 U$2.10
  Bottom 0.254: v22.93,58.07 22.93,57.44 23.36,56.8 23.36,55.35 24.45,54.26 24.45,48.67 23.43,47.66 23.36,47.1 v22.93,46.64
GND  (via drill 0.51)  (2 unrouted)
  Top 0.178: 8.86,19.1 MUX1.12 | MUX2.12 19.15,19.12 19.04,19.21 19.04,21.52 18.38,22.21 18.38,23.01 C6.1 18.34,23.63 | 17.69,32.29 17.69,32.39 | 17.69,32.29 17.69,32.27 | MUX4.12 30.88,19.19 | C7.1 18.91,56.46 | C9.1 26.74,47.81 | U$2.6 20.81,48.58 v20.69,48.7 | MUX3.27 27.95,38 28.69,38.74 28.69,42.15 v28.64,42.2 | v17.64,32.27 17.69,32.29 | 10.2,28.71 10.2,28.44 C4.2 | v27.98,23.1 27.8,23.27 | C2.1 17.86,34.06 18.2,34.25 C2.1
  Top 0.254: IC2.14 IC2.13 IC2.12 26.98,51.72 28.01,51.72 28.22,51.94 C8.1 | 22.98,56.17 IC4.3 | 22.98,56.17 21.73,54.9 20.78,54.9 C7.1 | U$1.3 26.1,42.83 26.74,42.2 v28.64,42.2 | 26.74,47.81 27.27,48.34 v28.16,48.34 | 35.8,25.59 36.7,25.59 MUX4.27 | U$2.2 25.6,46.14 26.02,46.57 26.02,46.6 C9.1 | 22.98,55.73 22.98,56.17
  Top 0.406: 8.86,19.1 7.51,19.11 7.51,26.93 8.96,28.35 C4.2 | MUX3.12 19.04,31.5 17.69,32.27 | C2.1 18.2,32.9 17.69,32.39 | 30.88,19.19 30.11,19.19 29.76,19.54 29.76,20.96 29.23,21.5 C3.2 29.11,22.03 28.69,22.03 27.98,22.74 v27.98,23.1 | 18.91,56.46 v18.91,55.28 | 26.08,52.31 IC2.13 | v25.49,51.01 26.08,52.31 | v11.98,29.68 10.91,29.68 10.2,28.71 | MUX1.27 15.67,25.62 16.07,25.23 16.07,24.52 v16.96,23.63 18.34,23.63 | 27.8,23.27 27.8,24.52 26.7,25.62 MUX2.27 | v35.09,25.76 35.63,25.76 35.8,25.59 | 22.98,55.73 25.47,53.25 25.47,52.93 26.08,52.31
  pour Bottom: 11.8,29.5 11.62,29.32 9.49,29.32
  pour Bottom: 5.49,71.59 1.49,67.59 1.49,3.97 4.22,1.24 40.92,1.24 44.92,5.24 44.92,67.59 40.92,71.59
JACK_IN
  Top 1.27: J1.PWR 35.63,54.77 36.9,53.5 36.9,47.15 35.52,45.77 35.52,35.99 32.2,32.67 IC1.VIN
LED_R
  Bottom 0.406: IC1.D12 10.73,68.23 9.46,68.99 7.18,68.99 5.15,66.45 5.15,64.42 9.46,60.61 9.46,58.83 7.69,57.06 7.69,54.26 U$4.P$1
LED_Y
  Bottom 0.406: IC1.D13 18.35,68.23 16.32,70.52 6.67,70.52 3.37,67.22 3.37,56.04 8.45,50.96 8.45,47.91 7.18,46.64 7.18,42.96 U$5.P$2
LM234EN
  Top 0.406: IC1.D10 17.85,63.15 19.75,65.06 24.2,65.06 24.83,64.42 IC3.4
MUX1OUT
  Top 0.178: MUX1.28 14.75,27.36 15.43,28.04 21.57,28.04 22.65,29.14 22.65,41.51 21.86,42.32 20.71,42.3 U$1.9
MUX2A
  Top 0.254: IC1.D8 15.94,58.07 17.85,56.17 17.85,49.82 19.12,48.55 19.12,47.28 19.75,46.64 U$2.8
MUX2B  (via drill 0.51)
  Top 0.254: U$2.4 25.71,47.14 25.85,47.28 25.85,48.8 22.49,52.15 22.49,53.93 v22.9,54.29
  Bottom 0.254: v22.9,54.29 20.87,56.34 16.78,60.43 15.48,60.43 IC1.D9
MUX2OUT
  Top 0.178: U$1.7 21.44,43.33 23,41.77 23,28.99 MUX2.28
MUX3OUT
  Top 0.178: MUX3.28 25.74,39.02 24.07,40.7 24.07,41.94 24.42,42.3 25.14,42.3 U$1.2
MUX4A  (via drill 0.51)
  Top 0.178: U$1.1 25.42,41.83 26.38,40.88 26.91,40.88 v27.78,40.24
  Bottom 0.178: IC1.D6 16.04,52.99 16.96,52.08 16.96,44.1 19.9,41.18 26.86,41.16 v27.78,40.24
MUX4B
  Top 0.254: IC1.D7 15.38,55.53 17.08,53.83 17.08,44.53 19.83,41.79 20.63,41.79 U$1.10
MUX4OUT
  Top 0.178: MUX4.28 36.52,26.5 35.98,26.83 35.45,27.01 25.67,27.01 23.36,29.32 23.36,42.3 24.21,43.33 U$1.4
MUX5OUT
  Top 0.178: U$2.9 20.09,46.14 19.62,45.68 19.62,43.19 19.98,42.83 U$1.8
MUX16A  (via drill 0.51)
  Top 0.178: MUX1.17 15.42,19.12 15.89,18.65 v16.8,18.63 | v27.24,18.55 26.74,18.65 26.2,19.19 25.8,19.19 MUX2.17 | v38.19,18.68 37.76,18.83 37.4,19.19 36.8,19.19 MUX4.17 | 25.79,31.45 MUX3.17 25.82,31.58 v28.23,31.58 29.23,31.2 34.41,31.2 36.16,28.08 v36.16,27.72
  Bottom 0.178: v16.8,18.63 16.42,18.65 15.71,18.65 14.47,19.36 14.11,19.36 13.93,19.19 11.62,19.19 8.07,22.74 8.07,27.72 13.58,33.23 13.58,41.23 15.18,42.83 16.3,42.81 19.45,39.71 25.67,39.71 27.83,37.68 27.83,34.43 28.69,33.13 28.69,32.11 28.41,31.78 v28.23,31.58 27.85,31.12 27.85,27.8 26.38,26.27 26.38,21.17 27.8,20.02 27.8,19.01 27.45,18.65 v27.24,18.55 | v36.16,27.72 37.43,27.72 39,25.59 39,19.19 38.65,18.83 v38.19,18.68
  Bottom 0.406: 15.18,42.83 IC1.D2
MUX16B  (via drill 0.51)
  Top 0.178: MUX1.16 15.36,18.47 v16.02,17.71 | MUX2.16 26.38,18.47 v27.12,17.3 | v38.09,17.33 37.78,17.91 37.48,18.32 37.28,18.47 MUX4.16 | MUX4.16 | 25.85,30.74 MUX3.16 25.79,30.89 27.5,30.89 v28.67,30.39 32.96,30.39 v34.25,27.9
  Bottom 0.178: IC1.D3 15.33,45.32 14.44,45.32 13.22,44.33 13.22,33.41 7.71,27.9 7.71,22.56 12.16,18.12 15.71,18.12 v16.02,17.71 | 15.33,45.37 15.32,45.26 15.33,44.61 15.43,44.38 19.6,40.19 25.95,40.19 28.31,38.01 28.31,34.68 29.05,33.38 29.05,30.74 28.74,30.49 v28.67,30.39 28.34,29.73 28.34,27.64 26.74,26.04 26.74,21.5 28.34,20.25 28.34,17.58 v27.12,17.3 | v34.25,27.9 34.56,27.9 35.8,28.61 37.48,28.61 38.55,27.14 39.51,25.76 39.54,18.3 39,17.76 v38.09,17.33
  Bottom 0.406: 15.33,45.32 15.33,45.27 15.32,45.26
MUX16C  (via drill 0.51)
  Top 0.178: MUX1.15 14.79,17.06 v15.18,16.77 | MUX2.15 25.74,16.98 v26.28,16.42 | v36.69,16.29 36.69,17.77 MUX4.15 | MUX3.15 26.63,29.07 v29.15,29.07
  Bottom 0.178: 15.36,47.81 16.45,46.9 16.45,44 19.85,40.67 26.05,40.67 28.89,38.06 28.89,34.6 29.45,33.64 29.45,30.34 29.23,29.5 v29.15,29.07 28.87,28.96 28.87,27.54 27.09,25.84 27.09,21.85 28.87,20.61 28.87,17.05 | v26.28,16.42 28.62,16.42 28.87,17.05 | 28.87,17.05 29.4,17.05 30.65,18.3 34.38,18.3 35.8,16.87 v36.69,16.29 | IC1.D4 14.04,47.91 12.87,46.74 12.87,33.59 7.36,28.08 7.36,22.38 11.98,17.76 13.4,17.76 14.29,16.87 14.65,16.87 v15.18,16.77
  Bottom 0.406: 15.36,47.81 15.36,47.86 IC1.D4
MUX16D  (via drill 0.51)
  Top 0.178: MUX1.14 v8.94,16.89 v8.96,16.87 | MUX2.14 19.94,17.73 v18.79,16.59 | MUX4.14 30.87,17.78 v30.85,16.95 | MUX3.14 20.45,29.31 21.79,29.32 22.29,29.82 22.29,40.24 21.4,41.13 19.55,41.13 16.52,44.15 16.52,49.49 15.54,50.45 IC1.D5
  Bottom 0.178: IC1.D5 15.31,50.43 12.51,47.99 12.51,33.76 7,28.25 7,18.83 v8.96,16.87 13.58,16.87 14.47,15.98 17.9,15.71 v18.79,16.59 19.34,15.86 19.34,12.22 15.61,9.25 15.61,5.52 17.74,2.9 26.99,2.9 30.88,7.12 v30.85,16.95
N$1
  Top 0.406: U$4.P$2 6.34,44.23 6.04,44.23 3.88,46.39 3.88,48.67 3.62,48.93 LED1.A | LED1.A 3.47,49.03 3.72,49.28 3.57,49.21 LED1.A
N$2
  Top 0.254: IC3.1 21.02,58.07 21.66,57.44 IC4.1
N$3  (via drill 0.51)
  Top 0.254: IC2.4 19.71,52.31 v20.89,53.5
  Bottom 0.254: RFB.P$2 11.24,56.55 13.53,54.26 20.13,54.26 v20.89,53.5
N$4
  Top 0.406: U$5.P$1 7.69,33.18 5.65,35.21 4.38,35.21 3.62,35.97 LED2.A
SCL  (via drill 0.51)
  Top 0.254: R1.P$2 27.37,57.44 28.01,56.8 28.01,55.28 IC2.16 26.92,55.35 v26.74,55.53 | v24.63,56.78 23.56,56.76 IC4.4
  Bottom 0.254: v24.63,56.78 v26.74,55.53 26.92,55.35 26.92,55.02 27.24,54.7 27.24,50.71 30.04,47.91 IC1.A5
SDA
  Top 0.254: IC4.5 24.62,59.6 25.01,59.22 25.01,57.79 25.54,57.26 25.54,57.23 | 25.54,57.23 25.54,54.08 26,53.63 26.9,53.63 IC2.15 28.4,53.61 29.28,52.74 29.28,51.72 IC1.A4 | R2.P$2 26.1,58.07 25.54,57.23
VCC  (via drill 0.51)  (3 unrouted)
  Top 0.178: 8.56,26.36 MUX1.1 8.97,26.3 | 19.86,38.64 MUX3.1 | C3.1 29.94,24.7 29.94,26.3 30.92,26.3 MUX4.1 | 19.97,26.3 MUX2.1 19.92,26.3 | v16.12,19.57 15.69,19.54 15.51,19.72 14.8,19.72 MUX1.18 | v27.07,19.67 25.8,19.72 MUX2.18 | v38.14,19.82 36.79,19.79 MUX4.18 | MUX3.18 25.76,32.16 26.56,32.16 26.54,32.15 | 26.1,61.04 v26.2,61.14 | 18.41,25.79 C6.2 18.37,25.23 | 27.93,32.77 27.9,32.72 v27.9,32.75 | 18.25,36.23 18.28,35.83 C2.2
  Top 0.254: R1.P$1 28.64,59.98 29.28,59.34 32.45,59.34 | IC4.2 22.31,56.18 21.66,55.53 21.02,55.53 20.39,56.17 20.39,57.92 19.98,58.33 19.33,58.33 | 19.33,58.33 19.12,58.07 | IC2.11 IC2.10 IC2.9 27.02,49.82 27.88,49.82 28.51,50.2 28.43,50.45 C8.2 28.86,50.24 29.91,49.18 32.45,49.18 | C7.2 19.33,58.33 | U$2.1 25.56,45.63 26.35,45.63 26.52,45.79 C9.2 28.43,45.79 29.28,46.64 32.45,46.64 | C5.1 26.52,43.68 26.1,44.1 | 25.47,44.1 25.45,44.1 U$1.5 | U$1.5 U$1.6 | U$1.5 25.2,43.83 25.47,44.1 | 26.1,44.1 25.47,44.1 | 32.45,44.1 26.1,44.1 | IC4.6 22.96,60.39 23.18,60.61 24.17,60.61 24.7,61.14 v26.2,61.14
  Top 0.406: R1.P$1 R2.P$1 26.1,61.04 | 8.56,26.36 9.54,27.31 11.27,27.3 C4.1 | MUX4.1 32.4,26.27 v33.31,25.41 | v11.45,26.12 10.02,26.12 9.85,26.3 8.97,26.3 | 26.56,32.16 27.93,32.77 27.93,34.3 28.39,34.81 28.36,37.3 29.58,38.9 IC1.5V | C7.2 19.12,60.46 v19.8,61.14 | 26.54,32.15 MUX3.18 | 18.41,25.79 18.91,26.3 19.92,26.3 | v16.96,25.23 18.37,25.23 | v29.23,25.41 C3.1 | 32.43,59.55 32.43,69.5 31.54,70.39 14.47,70.39 12.87,68.79 12.87,32.16 14.82,30.21 | 14.82,30.21 15.89,30.21 16.78,31.1 16.78,35.01 17.49,35.72 18.15,35.75 | 14.82,30.21 14.82,29.32 11.62,26.12 | 19.86,38.64 18.3,38.64 17.57,37.98 17.57,36.69 18.25,36.23
  Top 0.61: IC1.5V 31.18,40.29 32.45,41.56 32.45,44.1 32.45,46.64 32.45,49.18 32.45,51.98 32.45,59.34
  Top 0.813: U$6.P$2 32.66,52.19 32.45,51.98
  Bottom 0.178: v27.07,19.67 27.09,20.07 25.87,21.04 25.87,26.4 27.47,27.97 27.47,32.39 v27.9,32.75 | 15.71,19.72 v16.12,19.57 15.71,19.9 | 11.27,25.94 v11.45,26.12
  Bottom 0.406: v26.2,61.14 v19.8,61.14 | 15.71,19.72 11.27,24.16 11.27,25.94 | v16.96,25.23 15.71,23.98 15.71,19.9
  Bottom 0.61: v33.31,25.41 33.34,21.83 35.27,19.9 v38.14,19.82 | v29.23,25.41 31,25.41 32.25,28.08 32.68,29.09 33.49,31.1 33.47,38.44 32.22,39.53 31.21,40.39 IC1.5V

### Text on the board
tPlace: RFB | Z | AUTOIMPEDANCE v1.1 | FALL 2011